# Altium project clock.PrjPcb
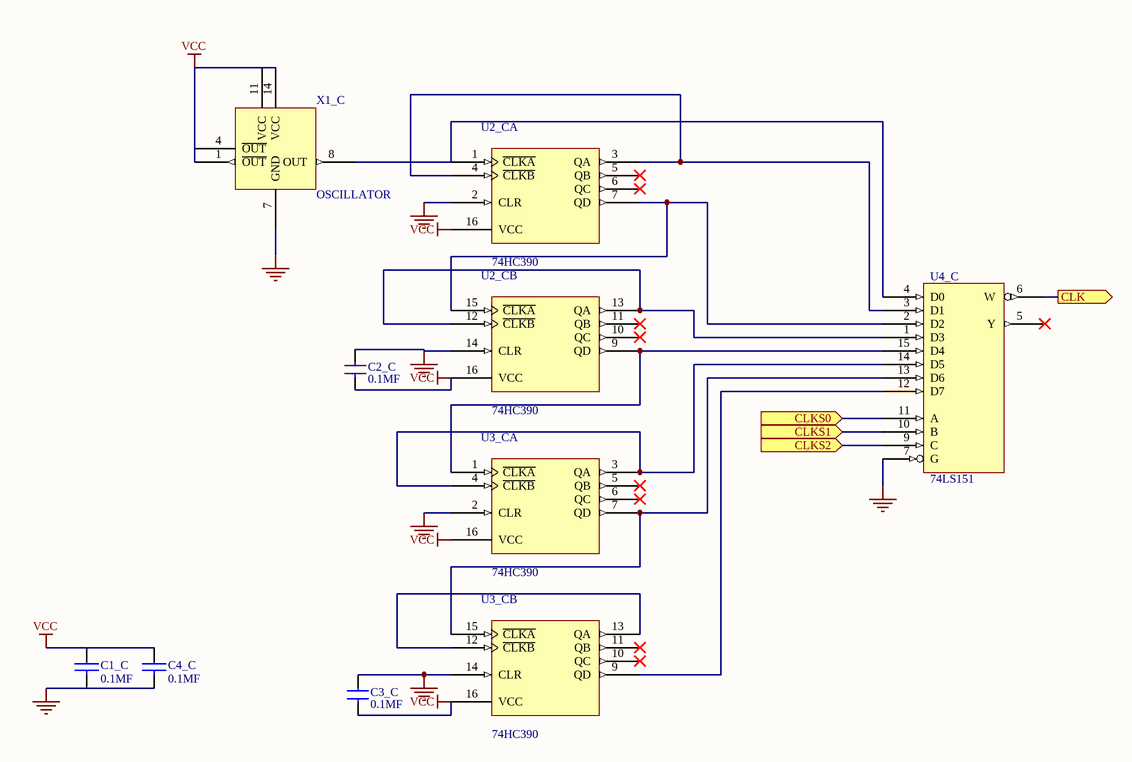
[diagram p0: clock.SchDoc]
1 sheet, 8 parts. Net scope: flat (ports and power ports of the same name join across sheets).

## Sheet clock.SchDoc: RevCode
size OrCAD A; DocumentNumber: Page Create Date; Revision: TitleBlock0; SheetNumber: 1; SheetTotal: 1

### Parts
C1_C  0.1MF  [RAD0.2]
C2_C  0.1MF  [RAD0.2]
C3_C  0.1MF  [RAD0.2]
C4_C  0.1MF  [RAD0.2]
U2_C  74HC390  [DIP-16]  (parts A,B of 2)
U3_C  74HC390  [DIP-16]  (parts A,B of 2)
U4_C  74LS151  [DIP-16]
X1_C  OSCILLATOR  [DIP-14]

### Ports
CLK (out), CLKS0 (in), CLKS1 (in), CLKS2 (in)

### Nets
GND: C1_C.2 C2_C.1 C3_C.1 C4_C.2 U2_C.2(CLR) U2_C.8(GND) U2_C.14(CLR) U3_C.2(CLR) U3_C.8(GND) U3_C.14(CLR) U4_C.7(G) U4_C.8(GND) X1_C.7(GND)
VCC: C1_C.1 C2_C.2 C3_C.2 C4_C.1 U2_C.16(VCC) U3_C.16(VCC) U4_C.16(VCC) X1_C.1(~{OUT}) X1_C.4(~{OUT}) X1_C.11(VCC) X1_C.14(VCC)
NetU2_C_1: U2_C.1(~{CLKA}) U4_C.4(D0) X1_C.8(OUT)
NetU2_C_3: U2_C.3(QA) U2_C.4(~{CLKB}) U4_C.3(D1)
NetU2_C_7: U2_C.7(QD) U2_C.15(~{CLKA}) U4_C.2(D2)
NetU2_C_9: U2_C.9(QD) U3_C.1(~{CLKA}) U4_C.15(D4)
NetU2_C_12: U2_C.12(~{CLKB}) U2_C.13(QA) U4_C.1(D3)
NetU3_C_3: U3_C.3(QA) U3_C.4(~{CLKB}) U4_C.14(D5)
NetU3_C_7: U3_C.7(QD) U3_C.15(~{CLKA}) U4_C.13(D6)
NetU3_C_9: U3_C.9(QD) U4_C.12(D7)
NetU3_C_12: U3_C.12(~{CLKB}) U3_C.13(QA)
NetU4_C_6: U4_C.6(W) ; port CLK
NetU4_C_9: U4_C.9(C) ; port CLKS2
NetU4_C_10: U4_C.10(B) ; port CLKS1
NetU4_C_11: U4_C.11(A) ; port CLKS0

Not connected (* = marked no-connect by the designer): U2_C 5(QB)* 6(QC)* 10(QC)* 11(QB)*; U3_C 5(QB)* 6(QC)* 10(QC)* 11(QB)*; U4_C 5(Y)*

### Library data of the parts
C1_C C4_C = CAP NP: Text Field1: 20; Text Field2: 10
C2_C C3_C = CAP: Capacitor; Value: 0.1MF
U2_C U3_C = 74HC390: Text Field1: 80; Text Field2: 70
U4_C = 74LS151: Text Field1: 60; Text Field2: 140